# Altium schematic sheet Main.SchDoc: Main
size A4; PageSetup: Record=PageOptions|CenterHorizontal=True|CenterVertical=True|PrintScale=0.97|XCorrection=1.00|YCorrection=1.00|PrintKind=0|BorderSize=5000000|LeftOffset=0|BottomOffset=0|Orientation=2|PaperLength=1000|PaperWidth=1000|Scale=100|PaperSource=7|PrintQuality=-4|MediaType=1|DitherType=10|PaperKind=A4|PrintScaleMode=1
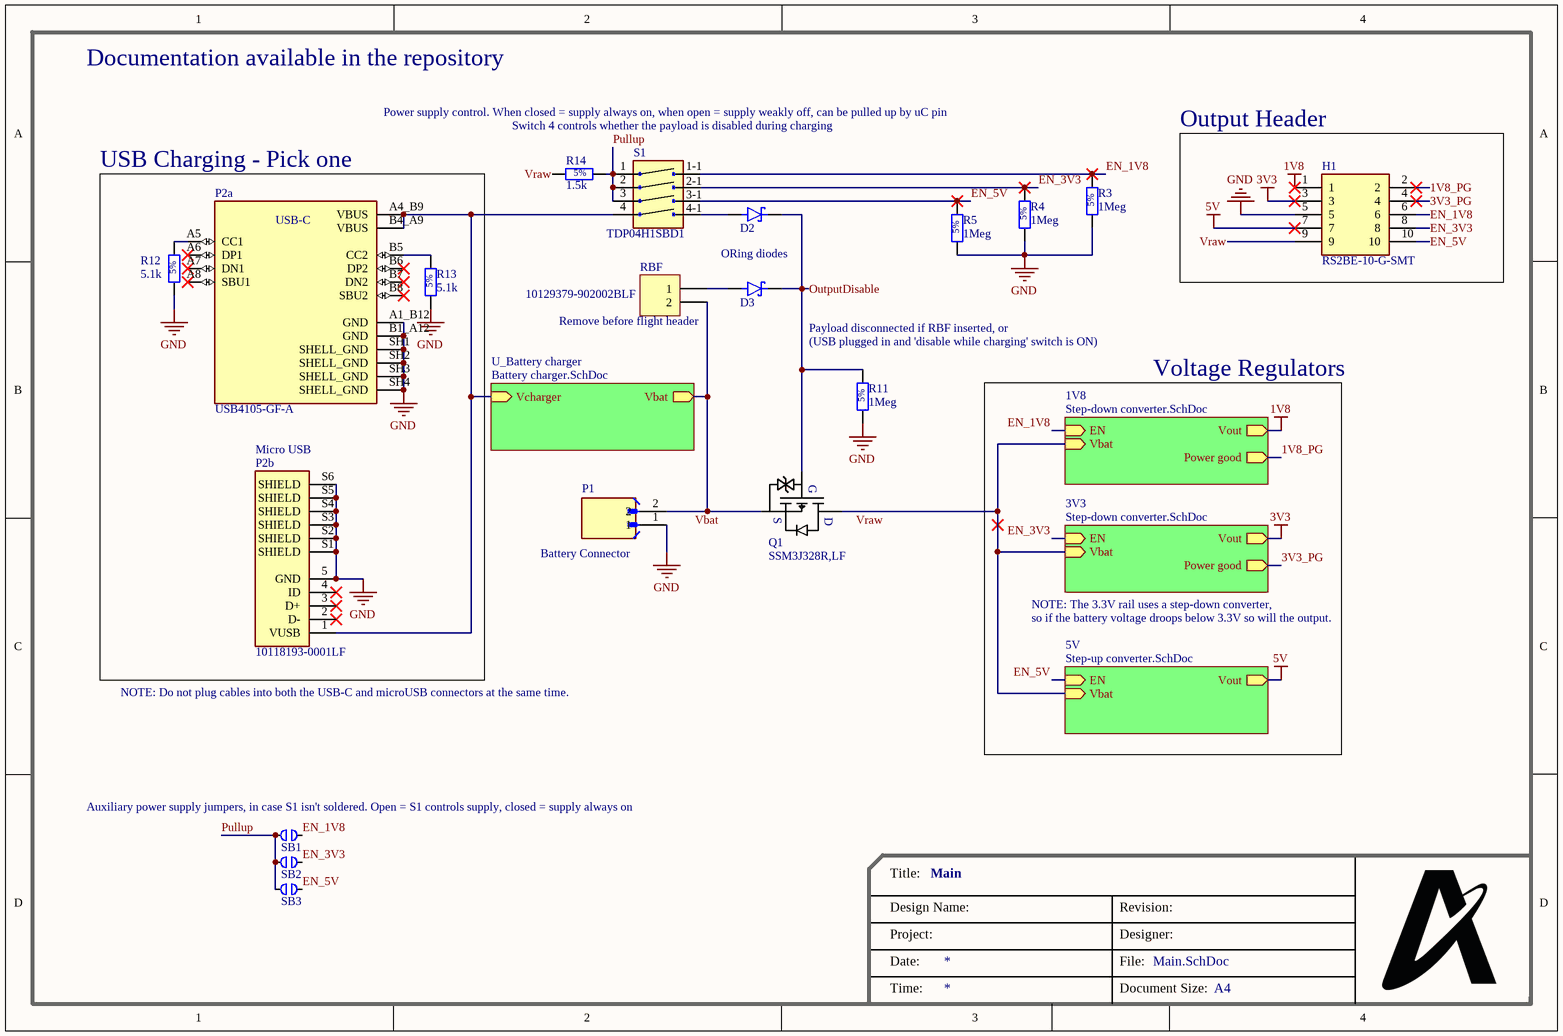
[diagram p0: Main.SchDoc]

## Parts
D2  SS0520_R1_00001  [SOD123-1.35mm-N]  (value not drawn)
D3  SS0520_R1_00001  [SOD123-1.35mm-N]  (value not drawn)
H1  RS2BE-10-G-SMT  [RS2BE10GSMT]
P1  B2B-PH-K-S(LF)(SN)  [JST_B2B-PH-K-S(LF)(SN)]  (value not drawn)
P2a  USB4105-GF-A  [GCT_USB4105-GF-A]
P2b  10118193-0001LF  [AMPHENOL_10118193-0001LF]
Q1  SSM3J328R,LF  [SOT23F-3-0.8mm]
R3  1Meg  [Resistor_0805_2012M-50N]
R4  1Meg  [Resistor_0805_2012M-50N]
R5  1Meg  [Resistor_0805_2012M-50N]
R11  1Meg  [Resistor_0805_2012M-50N]
R12  5.1k  [Resistor_0805_2012M-50N]
R13  5.1k  [Resistor_0805_2012M-50N]
R14  1.5k  [Resistor_0805_2012M-50N]
RBF  (no value)  [ECE-600102STTH-RA]  (no BOM)
S1  TDP04H1SBD1  [TDP04H1SBD1]
SB1  Solder Jumper Normally Open 0201  [Solder Bridge Open 0201]  (value not drawn)  (no BOM)
SB2  Solder Jumper Normally Open 0201  [Solder Bridge Open 0201]  (value not drawn)  (no BOM)
SB3  Solder Jumper Normally Open 0201  [Solder Bridge Open 0201]  (value not drawn)  (no BOM)

## Blocks framed on the sheet
Output Header: H1
USB Charging - Pick one: P2a P2b R12 R13

## Sub-sheets
1V8 = Step-down converter.SchDoc: EN (in), Vbat (in), Power good (out), Vout (out)  | R_FB1_Value: 200k; R_FB2_Value: 100k; R_FB1_MFPN: RG2012P-104-D-T5; R_FB2_MFPN: RG2012P-204-D-T5
3V3 = Step-down converter.SchDoc: EN (in), Vbat (in), Power good (out), Vout (out)  | R_FB1_Value: 910k; R_FB2_Value: 200k; R_FB2_MFPN: RG2012P-204-D-T5; R_FB1_MFPN: RG2012P-914-D-T5
5V = Step-up converter.SchDoc: EN (in), Vbat (in), Vout (out)  | R_FB1_Value: 910k; R_FB2_Value: 100k; R_FB1_MFPN: RG2012P-914-D-T5; R_FB2_MFPN: RG2012P-104-D-T5
U_Battery charger = Battery charger.SchDoc: Vbat (out), Vcharger (in)

## Nets
1V8: H1.1 ; sheet 1V8/Vout
3V3: H1.3 ; sheet 3V3/Vout
5V: H1.7 ; sheet 5V/Vout
GND: H1.5 P1.1 P2a.A1_B12(GND) P2a.B1_A12(GND) P2a.SH1(SHELL_GND) P2a.SH2(SHELL_GND) P2a.SH3(SHELL_GND) P2a.SH4(SHELL_GND) P2b.5(GND) P2b.S1(SHIELD) P2b.S2(SHIELD) P2b.S3(SHIELD) P2b.S4(SHIELD) P2b.S5(SHIELD) P2b.S6(SHIELD) R3.1 R4.1 R5.1 R11.1 R12.1 R13.1
1V8_PG: H1.2 ; sheet 1V8/Power good
3V3_PG: H1.4 ; sheet 3V3/Power good
EN_1V8: H1.6 R3.2 S1.8(1-1) SB1.2 ; sheet 1V8/EN
EN_3V3: H1.8 R4.2 S1.7(2-1) SB2.2 ; sheet 3V3/EN
EN_5V: H1.10 R5.2 S1.6(3-1) SB3.2 ; sheet 5V/EN
OutputDisable: D2.C D3.C Q1.1(G) R11.2
Pullup: R14.2 S1.1 S1.2 S1.3 SB1.1 SB2.1 SB3.1
Vbat: P1.2 Q1.2(S) RBF.2 ; sheet U_Battery charger/Vbat
Vraw: H1.9 Q1.3(D) R14.1 ; sheet 1V8/Vbat, sheet 3V3/Vbat, sheet 5V/Vbat
NetD2_A: D2.A S1.5(4-1)
NetD3_A: D3.A RBF.1
NetP2a_A4_B9: P2a.A4_B9(VBUS) P2a.B4_A9(VBUS) P2b.1(VUSB) S1.4 ; sheet U_Battery charger/Vcharger
NetP2a_A5: P2a.A5(CC1) R12.2
NetP2a_B5: P2a.B5(CC2) R13.2

Not connected (* = marked no-connect by the designer): P2a A6(DP1)* A7(DN1)* A8(SBU1)* B6(DP2)* B7(DN2)* B8(SBU2)*; P2b 2(D-)* 3(D+)* 4(ID)*

## Notes on the sheet
- Documentation available in the repository
- Power supply control. When closed = supply always on, when open = supply weakly off, can be pulled up by uC pin
- Switch 4 controls whether the payload is disabled during charging
- (near P2a) USB-C
- (near RBF) 10129379-902002BLF
- ORing diodes
- (near RBF) Remove before flight header
- Payload disconnected if RBF inserted, or
- (near R11) (USB plugged in and 'disable while charging' switch is ON)
- Voltage Regulators
- (near P2b) Micro USB
- (near P1) Battery Connector
- NOTE: The 3.3V rail uses a step-down converter,
- so if the battery voltage droops below 3.3V so will the output.
- NOTE: Do not plug cables into both the USB-C and microUSB connectors at the same time.
- (near SB1) Auxiliary power supply jumpers, in case S1 isn't soldered. Open = S1 controls supply, closed = supply always on
- Title:
- Design Name:
- Revision:
- Project:
- Date:
- Designer:
- File:
- Time:
- Document Size:
- A4

## Library data of the parts
D2 D3 = SS0520_R1_00001: Diode - Low Forward Voltage, Schottky, 385 mV @ 500 mA, 75 µA Reverse @ 10 V, SOD-123; APSS Standard Part: APSS Standard; Temp Range: -55°C ~ 125°C; Rated Voltage: 20V Reverse; MF Part No.: SS0520_R1_00001; Package: SOD-123; Supplier 1: Digikey; Supplier 1 Part No.: 3757-SS0520_R1_00001CT-ND
H1 = RS2BE-10-G-SMT: Receptacle Strip 10P 2.54mm Pitch SMT; MF Part No.: RS2BE-10-G-SMT; Supplier 1 Part No.: 2057-RS2BE-10-G-SMT-ND; Supplier 1: Digikey
P1 = B2B-PH-K-S(LF)(SN): Connector Header Through Hole 2 position 0.079 (2.00mm); MF Part No.: B2B-PH-K-S (LF)(SN); Supplier 1 Part No.: 455-1704-ND; Supplier 1: Digikey
P2a = USB4105-GF-A: USB-C (USB TYPE-C) USB 2.0 Receptacle Connector 24 (16+8 Dummy) Position Surface Mount, Right Angle; Through Hole; MF Part No.: USB4105-GF-A; Supplier 1 Part No.: 2073-USB4105-GF-ACT-ND; Supplier 1: Digikey
P2b = 10118193-0001LF: Micro USB 2.0, Input Output Connectors, B TYPE RECEPTACLE; MF: Amphenol ICC; MF Part No.: 10118193-0001LF
Q1 = SSM3J328R,LF: Transistor - MOSFET, P-Channel SSM3J328R,LF; APSS Standard Part: APSS Standard; Temp Range: 0°C ~ 150°C (TJ); Rated Voltage: 20 Vds; Power: 1W; MF Part No.: SSM3J328R,LF; Package: SOT23-3; Supplier 1: Digikey; Supplier 1 Part No.: SSM3J328RLFCT-ND
R3-R5 R11 = RMCF0805JT Series: Passive - Resistor Series, 0805, 5%, 100m - 22M, E24, 0.063W, 1/16W, ±200ppm/°C, -55°C ~ 155°C, 0805 (2012 Metric); MF Part No.: RMCF0805JT1M00; APSS Standard Part: APSS Standard; Power: 1/8W; Value Range: 100m ~ 22M; Rated Voltage: 150V; Tolerance: 5%; E Series: E24; Temp Range: -55°C ~ 155°C; Supplier 1: Digikey; Package: 0805; Temperature Coefficient: ±200ppm/°C; Value: 1Meg
R12 R13 = RMCF0805JT Series: Passive - Resistor Series, 0805, 5%, 100m - 22M, E24, 0.063W, 1/16W, ±200ppm/°C, -55°C ~ 155°C, 0805 (2012 Metric); MF Part No.: RMCF0805JT5K10; APSS Standard Part: APSS Standard; Power: 1/8W; Value Range: 100m ~ 22M; Rated Voltage: 150V; Tolerance: 5%; E Series: E24; Temp Range: -55°C ~ 155°C; Supplier 1: Digikey; Package: 0805; Temperature Coefficient: ±200ppm/°C; Value: 5.1k
R14 = RMCF0805JT Series: Passive - Resistor Series, 0805, 5%, 100m - 22M, E24, 0.063W, 1/16W, ±200ppm/°C, -55°C ~ 155°C, 0805 (2012 Metric); MF Part No.: RMCF0805JT1K50; APSS Standard Part: APSS Standard; Power: 1/8W; Value Range: 100m ~ 22M; Rated Voltage: 150V; Tolerance: 5%; E Series: E24; Temp Range: -55°C ~ 155°C; Supplier 1: Digikey; Package: 0805; Temperature Coefficient: ±200ppm/°C; Value: 1.5k
RBF = Header 2: Short Before Flight
S1 = TDP04H1SBD1: Switch; MF Part No.: TDP04H1SBD1; Supplier 1 Part No.: CKN9426-ND; Supplier 1: Digikey
SB1-SB3 = Solder Jumper Normally Open 0201: DEBUG: DEBUG